# Altium schematic sheet RS485 Tranciever.SchDoc: UART to RS485 Converter
size A4; Engineer: Jouveer Naidoo; Revision: 1; SheetNumber: 2; SheetTotal: 2; SPICEModelCacheHZVWZALK: <root> / <DocumentId>HZVWZALK</DocumentId> / <CacheFrame Number="0"> / <Model Name="cap" Kind="MDL"> / <Text>*Default semiconductor capacitor / .MODEL CAP C()</Text> / </Model> / </CacheFrame> / </root>; ProjectIdentifier: Spin Up
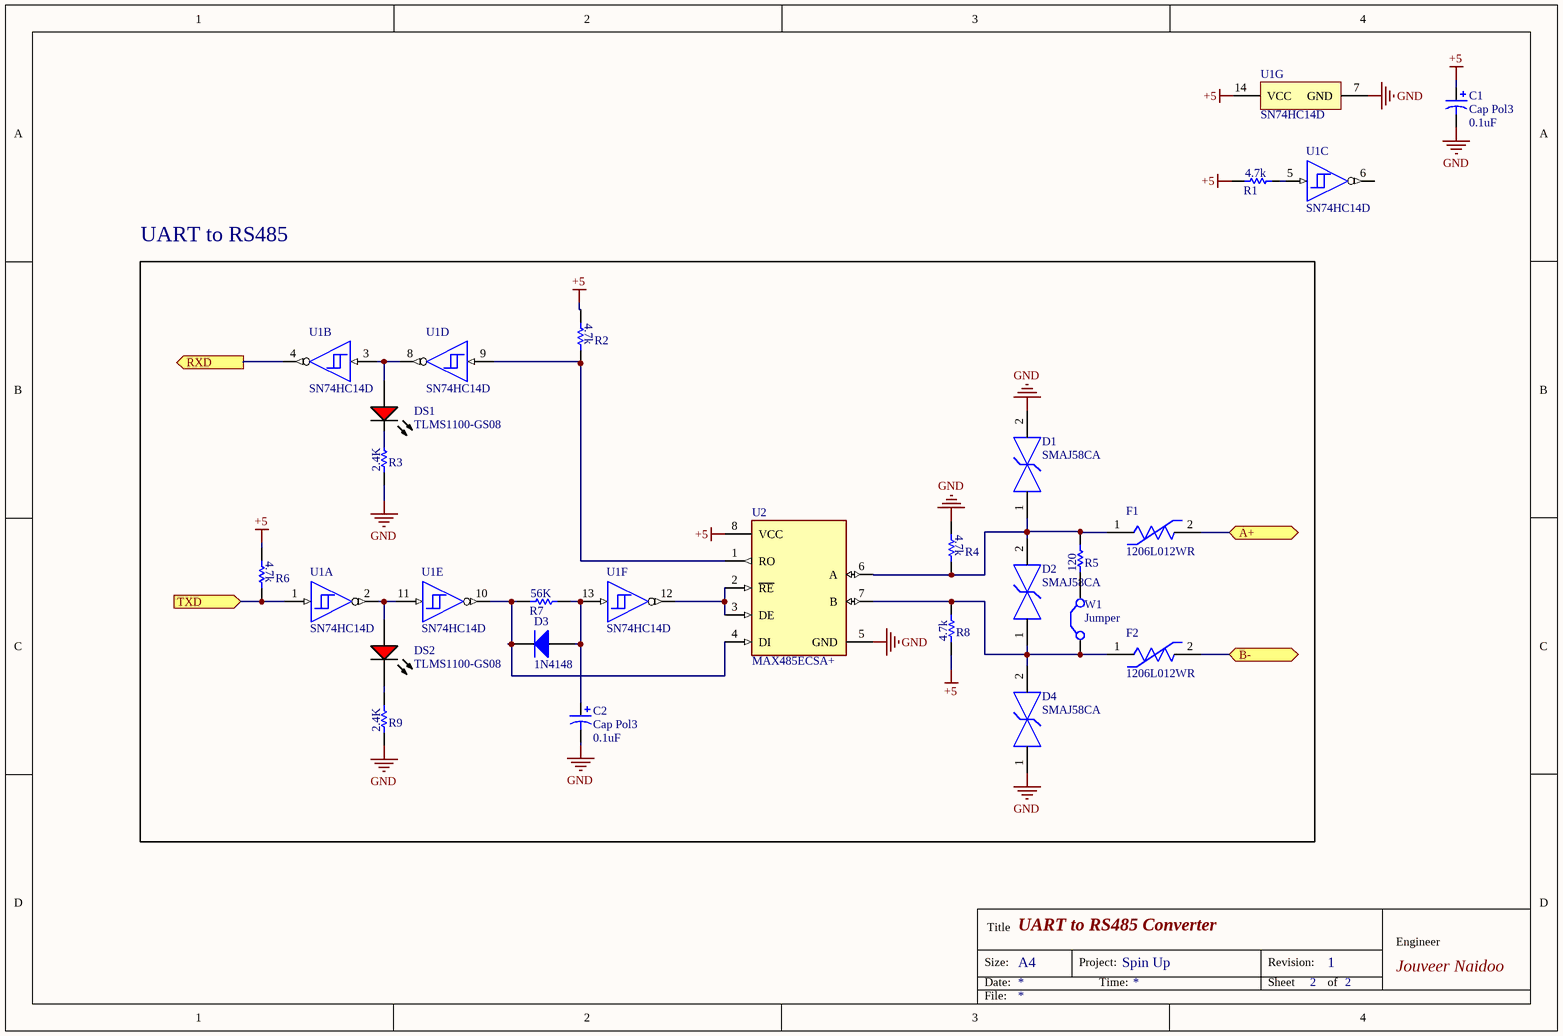
[diagram p0: RS485 Tranciever.SchDoc]

## Parts
C1  Cap Pol3  value 0.1uF  [C0805]
C2  Cap Pol3  value 0.1uF  [C0805]
D1  SMAJ58CA  [FP-SMAJ-MFG]
D2  SMAJ58CA  [FP-SMAJ-MFG]
D3  1N4148  [NXP-SOD27-2_V]
D4  SMAJ58CA  [FP-SMAJ-MFG]
DS1  TLMS1100-GS08  [VISH-TLMX1100_V]
DS2  TLMS1100-GS08  [VISH-TLMX1100_V]
F1  1206L012WR  [FP-1206L012WR-MFG]
F2  1206L012WR  [FP-1206L012WR-MFG]
R1  Resistor  [RESC0603X26X15NL03T05]  (value not drawn)
R2  Resistor  [RESC0603X26X15NL03T05]  (value not drawn)
R3  Resistor  [RESC0603X26X15NL03T05]  (value not drawn)
R4  Resistor  [RESC0603X26X15NL03T05]  (value not drawn)
R5  Resistor  [RESC0603X26X15NL03T05]  (value not drawn)
R6  Resistor  [RESC0603X26X15NL03T05]  (value not drawn)
R7  Resistor  [RESC0603X26X15NL03T05]  (value not drawn)
R8  Resistor  [RESC0603X26X15NL03T05]  (value not drawn)
R9  Resistor  [RESC0603X26X15NL03T05]  (value not drawn)
U1  SN74HC14D  [D0014A_N]  (parts A,B,C,D,E,F,G of 7)
U2  MAX485ECSA+  [FP-S8-5-MFG]
W1  Jumper  [RAD-0.2]

## Blocks framed on the sheet
UART to RS485: C2 D1-D4 DS1 DS2 F1 F2 R2-R9 U1 U2 W1

## Ports
A+ (bidir), B- (bidir), RXD (out), TXD (in)

## Nets
+5: C1.1 R1.1 R2.1 R6.1 R8.1 U1.14(VCC) U2.8(VCC)
GND: C1.2 C2.2 D1.2 D4.1 R3.1 R4.1 R9.1 U1.7(GND) U2.5(GND)
A+: F1.2 ; port A+
B-: F2.2 ; port B-
RXD: U1.4(~{2Y}) ; port RXD
TXD: R6.2 U1.1(1A) ; port TXD
NetC2_1: C2.1 D3.1(A) R7.2 U1.13(6A)
NetD1_1: D1.1 D2.2 F1.1 R4.2 R5.2 U2.6(A)
NetD2_1: D2.1 D4.2 F2.1 R8.2 U2.7(B) W1.1(C1)
NetD3_2: D3.2(K) R7.1 U1.10(~{5Y}) U2.4(DI)
NetDS1_1: DS1.1(A) U1.3(2A) U1.8(~{4Y})
NetDS1_2: DS1.2(K) R3.2
NetDS2_1: DS2.1(A) U1.2(~{1Y}) U1.11(5A)
NetDS2_2: DS2.2(K) R9.2
NetR1_2: R1.2 U1.5(3A)
NetR2_2: R2.2 U1.9(4A) U2.1(RO)
NetR5_1: R5.1 W1.2(C2)
NetU1_12: U1.12(~{6Y}) U2.2(~{RE}) U2.3(DE)

Not connected (* = marked no-connect by the designer): U1 6(~{3Y})

## Notes on the sheet
- Size:
- Date:
- Title
- A4
- Project:
- Time:
- Revision:
- Sheet
- of
- Engineer
- File:

## Library data of the parts
C1 C2 = Cap Pol3: Polarized Capacitor (Surface Mount); Published: 8-Jun-2000; LatestRevisionDate: 29-May-2009; LatestRevisionNote: IPC-7351 Footprint Added.; PackageReference: C0805; Publisher: Altium Limited; PackageDescription: Chip Capacitor
D1 D2 D4 = CMP-08607-000067-1: TVS DIODE 58V 93.6V DO214AC; Manufacturer: Littelfuse Inc; Breakdown Voltage: 64.4V; Peak Pulse Current: 4.3A; Peak Pulse Power: 400W; Direction: Bidirectional; Number Of Channels: 1; Max Junction Temp: +150°C; Reverse Standoff Voltage: 58V; Device Class L2: TVS Diodes; ComponentLink2Description: Datasheet; Lead Free: Yes; Height: 2.29mm; Automotive: No; Package: SMAJ; Digikey Description: TVS DIODE 58V 93.6V DO214AC; Temperature Range Low: -65°C; Device Class L1: Circuit Protection; Temperature Range High: +150°C; Mouser Description: In a Pack of 25, Littelfuse SMAJ58CA, Bi-Directional TVS Diode, 400W, 2-Pin DO-214AC; Octopart: https://octopart.com/smaj58ca-littelfuse-350202; ComponentLink2URL: https://www.littelfuse.com/~/media/electronics/datasheets/tvs_diodes/littelfuse_tvs_diode_smaj_datasheet.pdf.pdf; Temperature: -65°C to +150°C; Clamping Voltage: 93.6V; Device Class L3: unset; Manufacturer Part Number: SMAJ58CA; Category: Diode; RoHS: TRUE
D3 = CMP-004-00000-2: High Speed Diode, 100 V, 0.45 A, -65 to 175 degC, 2-Pin SOD27, RoHS, Bulk; Manufacturer: Fairchild; Elements: 1; Recovery Time: 4ns; Forward Current: 300mA; Power: 500mW; Forward Voltage: 1V; Max Surge Current: 4A; Peak Reverse Current: 5uA; Datasheet URL: http://www.nxp.com/documents/data_sheet/1N4148_1N4448.pdf; Min Operating Temperature: -65°C; Manufacturer URL: https://www.fairchildsemi.com/; Packaging: Bulk; Diameter: 1.91mm; Pins: 2; Package URL: http://www.nxp.com/documents/data_sheet/1N4148_1N4448.pdf; Package Reference: SOD27; Max Operating Temperature: 175°C; Package Quantity: 2000; Case/Package: DO; Datasheet Version: Aug-04; RoHS Compliant: True
DS1 DS2 = CMP-1666-00027-1: LED, RED, 2.1 V, -40 to 100 degC, 2-Pin SMD (0603), RoHS, Tape and Reel; Type (Capacitors): C0G; Resistance: 100000000000 Ohm; Capacitance: 12 pF; Voltage Rating: 50 V; Tolerance: 5%; Min Operating Temperature: -55degC; REACH SVHC: No SVHC; ComponentLink2Description: Datasheet; ComponentLink1URL: http://www.vishay.com/; Width: 0.8 mm; Package Quantity: 4000; PackageReference: TLMX1100; ComponentLink2URL: http://www.vishay.com/docs/83173/tlmb1100.pdf; Case/Package: 0603; Case Code (Metric): 1608; Packaging: Tape and Reel; Pins: 2; ComponentLink1Description: Manufacturer URL; Max Operating Temperature: 125degC; Height: 0.8 mm; Length: 1.6 mm; Mount: Surface Mount; PackageDescription: 2-Pin Surface Mount Device, Body 1.6 x 0.8 mm; DatasheetVersion: Rev. 2.7, 03/2016; Case Code (Imperial): 0603; Voltage Rating (DC): 50 V; RoHSCompliant: True; Radiation Hardening: No
F1 F2 = CMP-2000-05470-2: PTC RESET FUSE 30V 125MA 1206; Approvals: cULus; Max Power Dissipation: 600mW; Resistance: 6R; Max Current Rating: 100A; Time to Trip: 0.2s; Trip Current: 290mA; Voltage Rating: 30V; Max Voltage Rating (DC): 30V; Voltage Rating (DC): 30V; Working Voltage: 30V; Terminal Material: Copper; Lead Free: Lead Free; Length: 3.4mm; Packaging: Tape and Reel; Case Code (Metric): 3216; Max Operating Temperature: 85°C; Width: 1.8mm; Package Quantity: 3000; Height: 1.45mm; Hold Current: 125mA; RoHS Compliant: Yes; Termination: SMD/SMT; Operating Supply Voltage: 30V; Current Rating: 100A; Case Code (Imperial): 1206; Power Dissipation: 600mW; Series: 1206L; Case/Package: 1206; Min Operating Temperature: -40°C
R1 R2 R4 R6 R8 = SMTRes-4: Generic SMT Resistor; RES: 4.7k
R3 R9 = SMTRes-4: Generic SMT Resistor; RES: 2.4K
R5 = SMTRes-4: Generic SMT Resistor; RES: 120
R7 = SMTRes-4: Generic SMT Resistor; RES: 56K
U1 = CMP-1615-00302-3: Hex Schmitt-Trigger Inverters, D0014A, TUBE; Manufacturer: Texas Instruments; Input Type: CMOS; Rating: Catalog; Voltage(Nom)(V): 5; Schmitt Trigger: Yes; ICC @ Nom Voltage(Max)(mA): 0.02; tpd @ Nom Voltage(Max)(ns): 31; F @ Nom Voltage(Max)(Mhz): 20; Output Drive (IOL/IOH)(Max)(mA): -4/4; VCC(Max)(V): 6; Technology Family: HC; VCC(Min)(V): 2; Generic Part Number: SN74HC14; Operating Temperature Range(C): -40 to 85; PackageReference: D0014A; DatasheetVersion: SCLS085G; Code_JEDEC: MS-012; Output Type: CMOS; Bits(#): 6
U2 = CMP-05679-000003-1: IC TXRX RS485/RS422 8-SOIC; Manufacturer: Maxim Integrated; Number Of Receivers: 1; Simplex Duplex: Half Duplex; Data Rate: 2.5Mbits/s; Nominal Supply Current: 300-500uA; Standoff Height: 0.1mm; Min Supply Voltage: 4.75V; Max Supply Voltage: 5.25V; Interface: RS-485,RS-422; Device Class L3: RS-232 / RS-422 / RS-485 Interface ICs; Temperature Range Low: 0°C; Automotive: No; Temperature: 0°C to +70°C; Digikey Description: IC TXRX RS485/RS422 8-SOIC; ComponentLink2URL: https://datasheets.maximintegrated.com/en/ds/MAX1487E-MAX491E.pdf; Lead Free: Yes; Manufacturer Part Number: MAX485ECSA+; Device Class L1: Integrated Circuits (ICs); Device Class L2: Interface ICs; RoHS: TRUE; ComponentLink2Description: Datasheet; Category: IC; Package: S8-5; Octopart: https://octopart.com/max485ecsa%2B-maxim+integrated-39397871; Footprint Url: https://pdfserv.maximintegrated.com/land_patterns/90-0096.PDF; Mouser Description: MAX485E Series 2.5 Mbps 12 V Half-Duplex SMT RS 485 Transceiver - SOIC-8; Temperature Range High: +70°C; Number Of Transmitters: 1; Height: 1.75mm
W1 = Jumper: Jumper Wire; Published: 24-Mar-1999; LatestRevisionDate: 17-Jul-2002; LatestRevisionNote: Re-released for DXP Platform.; PackageReference: RAD-0.2; Publisher: Altium Limited; PackageDescription: Radial Cap, Thru-Hole; 2 Leads; 0.2 in Pin Spacing